# EAGLE design polarshield v1.4 (EAGLE 6.4)
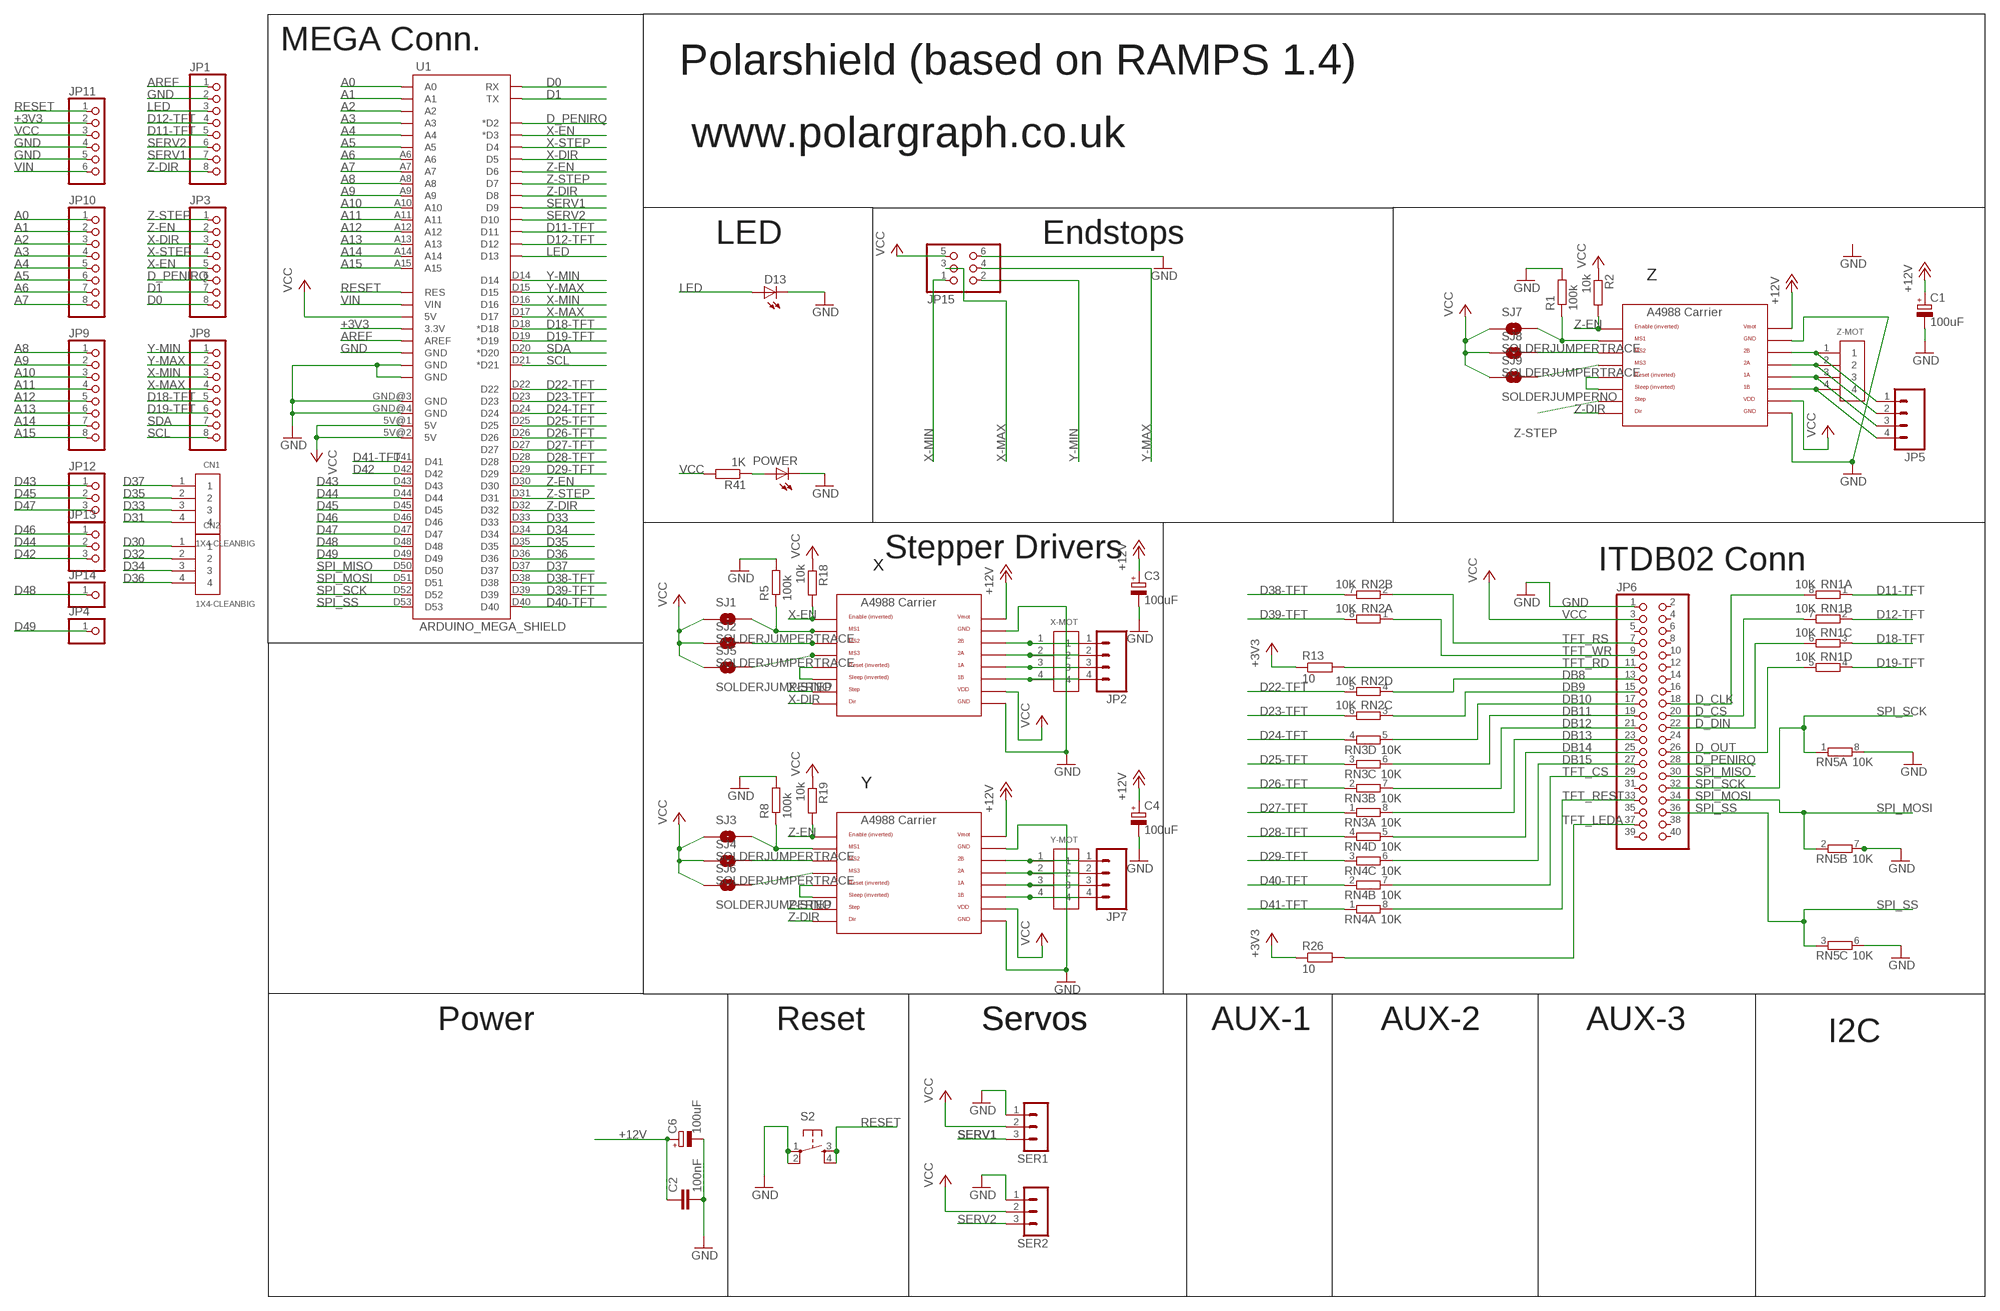
[diagram p0: schematic, sheet 1]

## Parts
C1  100uF  CPOL-EU153CLV-0605  [153CLV-0605]
C2  100nF  C-EUC0805  [C0805]
C3  100uF  CPOL-EU153CLV-0605  [153CLV-0605]
C4  100uF  CPOL-EU153CLV-0605  [153CLV-0605]
C6  100uF  CPOL-EU153CLV-0605  [153CLV-0605]
CN1  1X4-CLEANBIG  [1X04-CLEANBIG]
CN2  1X4-CLEANBIG  [1X04-CLEANBIG]
D13  LEDCHIP-LED0805  [CHIP-LED0805]
JP1  PINHD-1X8CLEANBIG  [1X08-CLEANBIG]
JP2  M04SCREW  [SCREWTERMINAL-3.5MM-4]
JP3  PINHD-1X8CLEANBIG  [1X08-CLEANBIG]
JP4  PINHD-1X1CB  [1X01-CLEANBIG]
JP5  M04SCREW  [SCREWTERMINAL-3.5MM-4]
JP6  PINHD-2X20  [2X20]
JP7  M04SCREW  [SCREWTERMINAL-3.5MM-4]
JP8  PINHD-1X8CLEANBIG  [1X08-CLEANBIG]
JP9  PINHD-1X8CLEANBIG  [1X08-CLEANBIG]
JP10  PINHD-1X8CLEANBIG  [1X08-CLEANBIG]
JP11  PINHD-1X6CB  [1X06-CLEANBIG]
JP12  PINHD-1X3CB  [1X03-CLEANBIG]
JP13  PINHD-1X3CB  [1X03-CLEANBIG]
JP14  PINHD-1X1CB  [1X01-CLEANBIG]
JP15  PINHD-2X3  [2X03]
POWER  LEDCHIP-LED0805  [CHIP-LED0805]
R1  100k  R-EU_R0805  [R0805]
R2  10k  R-EU_R0805  [R0805]
R5  100k  R-EU_R0805  [R0805]
R8  100k  R-EU_R0805  [R0805]
R13  10  R-EU_R0805  [R0805]
R18  10k  R-EU_R0805  [R0805]
R19  10k  R-EU_R0805  [R0805]
R26  10  R-EU_R0805  [R0805]
R41  1K  R-EU_R0805  [R0805]
RN1  10K  4R-NEXBS8V  [EXBS8V]
RN2  10K  4R-NEXBS8V  [EXBS8V]
RN3  10K  4R-NEXBS8V  [EXBS8V]
RN4  10K  4R-NEXBS8V  [EXBS8V]
RN5  10K  4R-NEXBS8V  [EXBS8V]
S2  TAC_SWITCHPTH  [TACTILE-PTH]
SER1  3PIN-HEADER  [3PIN-HEADER]
SER2  3PIN-HEADER  [3PIN-HEADER]
SJ1  SOLDERJUMPERTRACE  [SJ_2S-TRACE]
SJ2  SOLDERJUMPERTRACE  [SJ_2S-TRACE]
SJ3  SOLDERJUMPERTRACE  [SJ_2S-TRACE]
SJ4  SOLDERJUMPERTRACE  [SJ_2S-TRACE]
SJ5  SOLDERJUMPERNO  [SJ_2S-NO]
SJ6  SOLDERJUMPERNO  [SJ_2S-NO]
SJ7  SOLDERJUMPERTRACE  [SJ_2S-TRACE]
SJ8  SOLDERJUMPERTRACE  [SJ_2S-TRACE]
SJ9  SOLDERJUMPERNO  [SJ_2S-NO]
U1  ARDUINO_MEGA_SHIELD  [ARDUINO_MEGA_SHIELD]
U$1  A4988BREAKOUT  [A4988BREAKOUT]
U$6  A4988BREAKOUT  [A4988BREAKOUT]
U$7  A4988BREAKOUT  [A4988BREAKOUT]
X-MOT  1X4-BIG  [1X04-BIG]
Y-MOT  1X4-BIG  [1X04-BIG]
Z-MOT  1X4-BIG  [1X04-BIG]

## Nets
+3V3: JP11.2 R13.1 R26.1 U1.3.3V
+12V [vcc]: C1.+ C2.1 C3.+ C4.+ C6.+ U$1.VMOT U$6.VMOT U$7.VMOT
A0: JP10.1 U1.A0
A1: JP10.2 U1.A1
A2: JP10.3 U1.A2
A3: JP10.4 U1.A3
A4: JP10.5 U1.A4
A5: JP10.6 U1.A5
A6: JP10.7 U1.A6
A7: JP10.8 U1.A7
A8: JP9.1 U1.A8
A9: JP9.2 U1.A9
A10: JP9.3 U1.A10
A11: JP9.4 U1.A11
A12: JP9.5 U1.A12
A13: JP9.6 U1.A13
A14: JP9.7 U1.A14
A15: JP9.8 U1.A15
AREF: JP1.1 U1.AREF
D0: JP3.8 U1.RX
D1: JP3.7 U1.TX
D11-TFT: JP1.5 RN1.1 U1.D11
D12-TFT: JP1.4 RN1.2 U1.D12
D18-TFT: JP8.5 RN1.3 U1.D18(*D18)
D19-TFT: JP8.6 RN1.4 U1.D19(*D19)
D22-TFT: RN2.5 U1.D22
D23-TFT: RN2.6 U1.D23
D24-TFT: RN3.4 U1.D24
D25-TFT: RN3.3 U1.D25
D26-TFT: RN3.2 U1.D26
D27-TFT: RN3.1 U1.D27
D28-TFT: RN4.4 U1.D28
D29-TFT: RN4.3 U1.D29
D30: CN2.1
D31: CN1.4
D32: CN2.2
D33: CN1.3 U1.D33
D34: CN2.3 U1.D34
D35: CN1.2 U1.D35
D36: CN2.4 U1.D36
D37: CN1.1 U1.D37
D38-TFT: RN2.7 U1.D38
D39-TFT: RN2.8 U1.D39
D40-TFT: RN4.2 U1.D40
D41-TFT: RN4.1 U1.D41
D42: JP13.3 U1.D42
D43: JP12.1 U1.D43
D44: JP13.2 U1.D44
D45: JP12.2 U1.D45
D46: JP13.1 U1.D46
D47: JP12.3 U1.D47
D48: JP14.1 U1.D48
D49: JP4.1 U1.D49
D_CLK: JP6.18 RN1.8
D_CS: JP6.20 RN1.7
D_DIN: JP6.22 RN1.6
D_OUT: JP6.26 RN1.5
D_PENIRQ: JP3.6 JP6.28 U1.D2(*D2)
DB8: JP6.13 RN2.4
DB9: JP6.15 RN2.3
DB10: JP6.17 RN3.5
DB11: JP6.19 RN3.6
DB12: JP6.21 RN3.7
DB13: JP6.23 RN3.8
DB14: JP6.25 RN4.5
DB15: JP6.27 RN4.6
GND: C1.- C2.2 C3.- C4.- C6.- D13.C JP1.2 JP6.1 JP11.4 JP11.5 JP15.6 POWER.C R1.2 R5.2 R8.2 RN5.6 RN5.7 RN5.8 S2.1 S2.2 SER1.1 SER2.1 U1.GND@0(GND) U1.GND@1(GND) U1.GND@2(GND) U1.GND@3(GND) U1.GND@4(GND) U$1.GND U$1.GND@0(GND) U$6.GND U$6.GND@0(GND) U$7.GND U$7.GND@0(GND)
LED: D13.A JP1.3 U1.D13
N$1: U$6.RST U$6.SLP(SLEEP)
N$2: POWER.A R41.1
N$3: R5.1 SJ1.2 U$6.MS1
N$4: SJ8.2 U$1.MS2
N$5: SJ9.2 U$1.MS3
N$6: R1.1 SJ7.2 U$1.MS1
N$7: JP5.1 U$1.2B Z-MOT.1
N$8: JP5.2 U$1.2A Z-MOT.2
N$9: JP5.3 U$1.1A Z-MOT.3
N$10: SJ2.2 U$6.MS2
N$11: JP5.4 U$1.1B Z-MOT.4
N$12: SJ5.2 U$6.MS3
N$13: U$7.RST U$7.SLP(SLEEP)
N$14: U$1.RST U$1.SLP(SLEEP)
N$17: SJ4.2 U$7.MS2
N$21: JP2.1 U$6.2B X-MOT.1
N$22: JP2.2 U$6.2A X-MOT.2
N$26: JP2.3 U$6.1A X-MOT.3
N$27: JP2.4 U$6.1B X-MOT.4
N$28: JP7.1 U$7.2B Y-MOT.1
N$29: JP7.2 U$7.2A Y-MOT.2
N$30: JP7.3 U$7.1A Y-MOT.3
N$31: SJ6.2 U$7.MS3
N$33: R8.1 SJ3.2 U$7.MS1
N$36: JP7.4 U$7.1B Y-MOT.4
RESET: JP11.1 S2.3 S2.4 U1.RES
SCL: JP8.8 U1.D21(*D21)
SDA: JP8.7 U1.D20(*D20)
SERV1: JP1.7 SER1.3 U1.D9
SERV2: JP1.6 SER2.3 U1.D10
SPI_MISO: JP6.30 U1.D50
SPI_MOSI: JP6.34 RN5.2 U1.D51
SPI_SCK: JP6.32 RN5.1 U1.D52
SPI_SS: JP6.36 RN5.3 U1.D53
TFT_CS: JP6.29 RN4.7
TFT_LEDA: JP6.37 R26.2
TFT_RD: JP6.11 R13.2
TFT_REST: JP6.33 RN4.8
TFT_RS: JP6.7 RN2.2
TFT_WR: JP6.9 RN2.1
VCC: JP6.3 JP11.3 JP15.5 R2.1 R18.1 R19.1 R41.2 SER1.2 SER2.2 SJ1.1 SJ2.1 SJ3.1 SJ4.1 SJ5.1 SJ6.1 SJ7.1 SJ8.1 SJ9.1 U1.5V@0(5V) U1.5V@1(5V) U1.5V@2(5V) U$1.VDD U$6.VDD U$7.VDD
VIN [vcc]: JP11.6 U1.VIN
X-DIR: JP3.3 U1.D5 U$6.DIR
X-EN: JP3.5 R18.2 U1.D3(*D3) U$6.EN
X-MAX: JP8.4 JP15.3 U1.D17
X-MIN: JP8.3 JP15.1 U1.D16
X-STEP: JP3.4 U1.D4 U$6.STEP
Y-MAX: JP8.2 JP15.4 U1.D15
Y-MIN: JP8.1 JP15.2 U1.D14
Z-DIR: JP1.8 U1.D8 U1.D32 U$1.DIR U$7.DIR
Z-EN: JP3.2 R2.2 R19.2 U1.D6 U1.D30 U$1.EN U$7.EN
Z-STEP: JP3.1 U1.D7 U1.D31 U$1.STEP U$7.STEP
Unconnected: JP6.2 JP6.4 JP6.5 JP6.6 JP6.8 JP6.10 JP6.12 JP6.14 JP6.16 JP6.24 JP6.31 JP6.35 JP6.38 JP6.39 JP6.40 RN5.4 RN5.5

## Notes on the sheet
- MEGA Conn.
- Polarshield (based on RAMPS 1.4)
- www.polargraph.co.uk
- LED | Endstops
- Z
- Stepper Drivers
- X | ITDB02 Conn
- Y
- Power | Reset | Servos | Servos | AUX-1 | AUX-2 | AUX-3
- I2C

## Library data of the parts
C1 C3 C4 C6 = rcl:CPOL-EU: POLARIZED CAPACITOR, European symbol
C2 = resistor:C-EU: CAPACITOR, European symbol
CN1 CN2 X-MOT Y-MOT Z-MOT = adafruit:1X4: 4-pin connector
D13 POWER = led:LED: LED OSRAM: - CHIPLED LG R971, LG N971, LY N971, LG Q971, LY Q971, LO R971, LY R971 LH N974, LH R974 LS Q976, LO Q976, LY Q976 LO Q996 - Hyper CHIPLED LW Q18S LB Q993, LB Q99A, LB R99A - SideLED LS A670, LO A670, LY A670, LG A670, LP A670 LB A673, LV A673, LT A673, LW A673 LH A674 LY A675 LS A676, LA A676, LO A676, LY A676, LW A676 LS A679, LY A679, LG A679 - Hyper Micro SIDELED® LS Y876, LA Y876, LO Y876, LY Y876 LT Y87S - SmartLED LW L88C, LW L88S LB L89C, LB L89S, LG L890 LS L89K, LO L89K, LY L89K LS L896, LA L896, LO L896, LY L896 - TOPLED LS T670, LO T670, LY T670, LG T670, LP T670 LSG T670, LSP T670, LSY T670, LOP T670, LYG T670 LG T671, LOG T671, LSG T671 LB T673, LV T673, LT T673, LW T673 LH T674 LS T676, LA T676, LO T676, LY T676, LB T676, LH T676, LSB T676, LW T676 LB T67C, LV T67C, LT T67C, LS T67K, LO T67K, LY T67K, LW E67C LS E67B, LA E67B, LO E67B, LY E67B, LB E67C, LV E67C, LT E67C LW T67C LS T679, LY T679, LG T679 LS T770, LO T770, LY T770, LG T770, LP T770 LB T773, LV T773, LT T773, LW T773 LH T774 LS E675, LA E675, LY E675, LS T675 LS T776, LA T776, LO T776, LY T776, LB T776 LHGB T686 LT T68C, LB T68C - Hyper Mini TOPLED® LB M676 - Mini TOPLED Santana® LG M470 LS M47K, LO M47K, LY M47K Source: http://www.osram.convergy.de LUXEON: - LUMILED® LXK2-PW12-R00, LXK2-PW12-S00, LXK2-PW14-U00, LXK2-PW14-V00 LXK2-PM12-R00, LXK2-PM12-S00, LXK2-PM14-U00 LXK2-PE12-Q00, LXK2-PE12-R00, LXK2-PE12-S00, LXK2-PE14-T00, LXK2-PE14-U00 LXK2-PB12-K00, LXK2-PB12-L00, LXK2-PB12-M00, LXK2-PB14-N00, LXK2-PB14-P00, LXK2-PB14-Q00 LXK2-PR12-L00, LXK2-PR12-M00, LXK2-PR14-Q00, LXK2-PR14-R00 LXK2-PD12-Q00, LXK2-PD12-R00, LXK2-PD12-S00 LXK2-PH12-R00, LXK2-PH12-S00 LXK2-PL12-P00, LXK2-PL12-Q00, LXK2-PL12-R00 Source: www.luxeon.com KINGBRIGHT: KA-3528ASYC Source: www.kingbright.com
JP1 JP3 JP8-JP10 = adafruit:PINHD-1X8: PIN HEADER
JP2 JP5 JP7 = SparkFun:M04: Header 4 Standard 4-pin 0.1" header. Use with straight break away headers (SKU : PRT-00116), right angle break away headers (PRT-00553), swiss pins (PRT-00743), machine pins (PRT-00117), and female headers (PRT-00115). Molex polarized connector foot print use with SKU : PRT-08231 with associated crimp pins and housings. 1MM SMD Version SKU: PRT-10208
JP4 JP14 = adafruit:PINHD-1X1: Pin header 1x1 for 0.1" spacing With round pins
JP6 = pinhead:PINHD-2X20: PIN HEADER
JP11 = adafruit:PINHD-1X6: PIN HEADER
JP12 JP13 = adafruit:PINHD-1X3: PIN HEADER
JP15 = pinhead:PINHD-2X3: PIN HEADER
R1 R2 R5 R8 R18 R19 R41 = rcl:R-EU_: RESISTOR, European symbol
R13 R26 = resistor:R-EU_: RESISTOR, European symbol
RN1-RN5 = resistor-dil:4R-N: Array Chip Resistor Source: RS Component / Phycomp; OC_FARNELL: unknown; OC_NEWARK: unknown
S2 = SparkFun:TAC_SWITCH: Momentary Switch Button commonly used for reset or general input. Spark Fun Electronics SKU : COM-00097
SER1 SER2 = ultimachine:3PIN-HEADER: PIN HEADER
SJ1-SJ9 = SparkFun:SOLDERJUMPER: Solder Jumper Standard SMD solder jumper. Used to automate production. Two varients : Normally Open and Normally Closed are the same, but have different paste layers. NC will have a large amount of paste and should jumper during reflow.
U1 = RepRapjr:ARDUINO_MEGA_SHIELD
U$1 U$6 U$7 = RepRapjr:A4988BREAKOUT

## Net classes
1 gnd12: width 2.54 mm
2 gnd5: width 2.54 mm
3 vmot: width 2.54 mm
4 vcc: width 0.406 mm
5 signal: width 0.406 mm

## Board
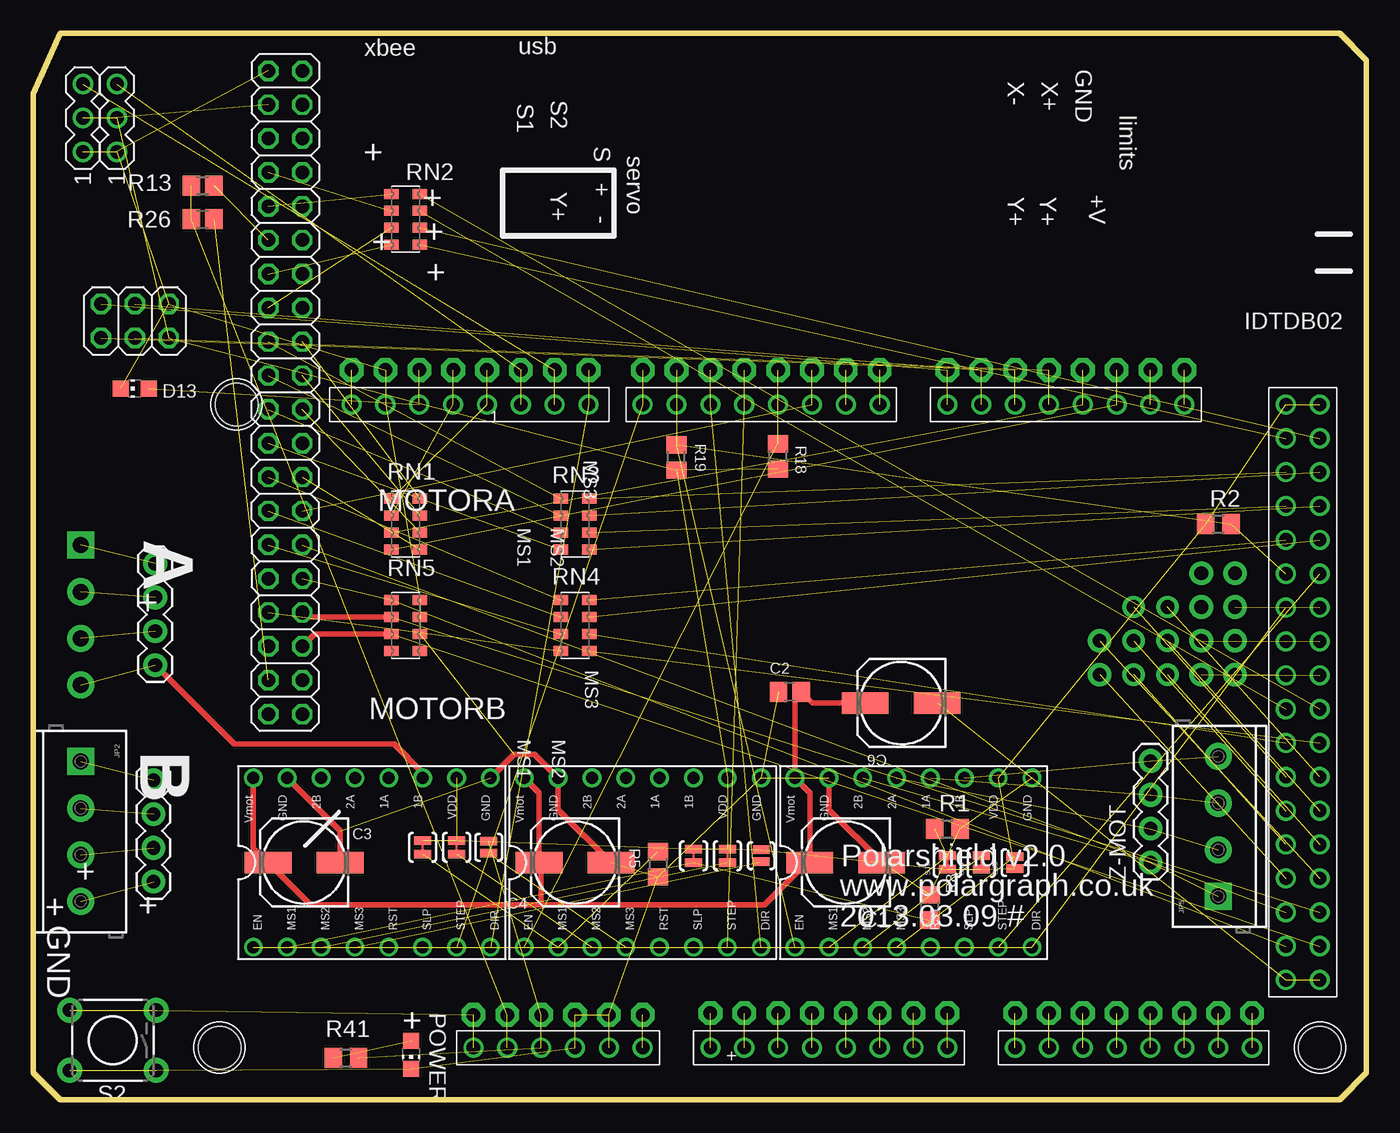
[diagram p1: board, top side]
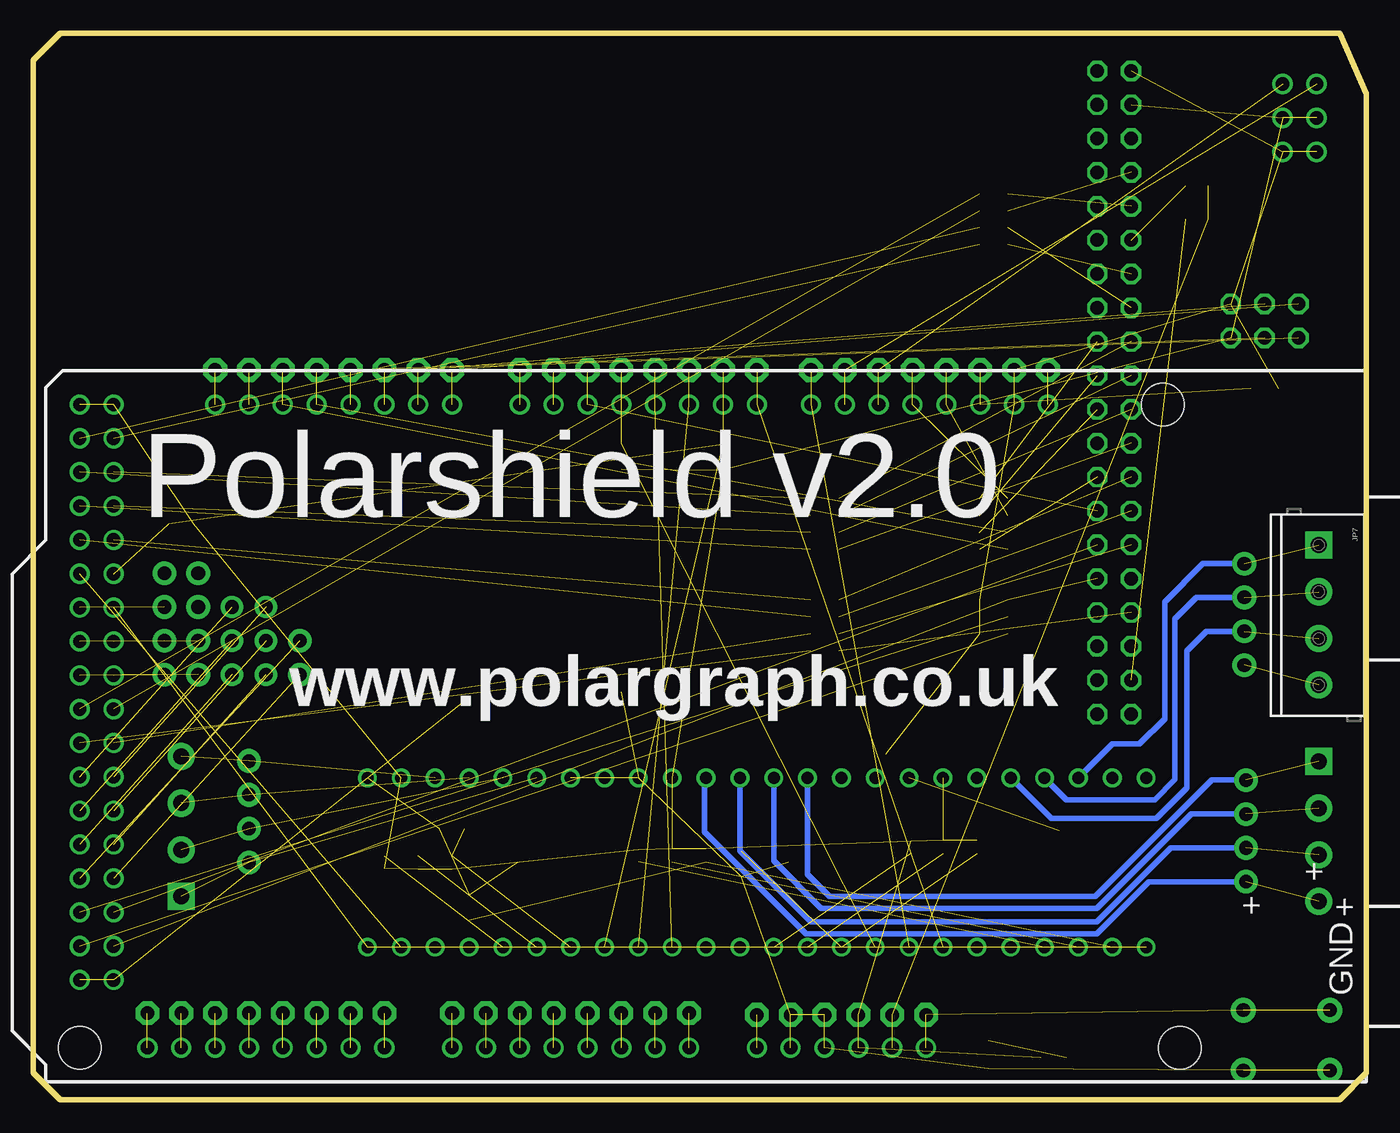
[diagram p2: board, bottom side, seen from below]

Size 100 x 80 mm. Coordinates in mm from the lower left corner, seen from the top.
Outline: 100,2 100,78 98,80 2,80 0,75.46 0,2 2,0 98,0 100,2
Copper layers (1*16): Top 0.035mm / dielectric 1.5mm / Bottom 0.035mm
Design rules "ITead_rule": minimum track width 6mil, minimum drill 12mil, track to track 6mil, track to pad 6mil, pad to pad 6mil, via to via 6mil, smd to smd 0mil, copper to edge 10mil, drill to drill 10mil, minimum pad ring 10mil, minimum via ring 6mil, stop-mask expansion 2mil, vias tented up to drill 100mil, thermal gap 10mil

### Footprints (pad centres in the part's own frame; a part is rotated, then mirrored left to right if it is on the bottom)
153CLV-0605 = smd 3.5 x 1.6: + 2.7,0; - -2.7,0
C0805 = smd 1.3 x 1.5: 1 -0.85,0; 2 0.85,0
1X04-CLEANBIG = drill 1.016 pad 1.778: 1 -3.81,0; 2 -1.27,0; 3 1.27,0; 4 3.81,0
CHIP-LED0805 = smd 1.2 x 1.2: A 0,-1.05; C 0,1.05
1X08-CLEANBIG = drill 1.016 pad 1.778 octagon: 1 -8.89,0; 2 -6.35,0; 3 -3.81,0; 4 -1.27,0; 5 1.27,0; 6 3.81,0; 7 6.35,0; 8 8.89,0
SCREWTERMINAL-3.5MM-4 = drill 1.2 pad 2.032 square: 1 0,0 | drill 1.2 pad 2.032: 2 3.5,0; 3 7,0; 4 10.5,0
1X01-CLEANBIG = drill 1.016 pad 1.778: 1 0,0
2X20 = drill 1.016 octagon: 1 -24.13,-1.27; 2 -24.13,1.27; 3 -21.59,-1.27; 4 -21.59,1.27; 5 -19.05,-1.27; 6 -19.05,1.27; 7 -16.51,-1.27; 8 -16.51,1.27; 9 -13.97,-1.27; 10 -13.97,1.27; 11 -11.43,-1.27; 12 -11.43,1.27; 13 -8.89,-1.27; 14 -8.89,1.27; 15 -6.35,-1.27; 16 -6.35,1.27; 17 -3.81,-1.27; 18 -3.81,1.27; 19 -1.27,-1.27; 20 -1.27,1.27; 21 1.27,-1.27; 22 1.27,1.27; 23 3.81,-1.27; 24 3.81,1.27; 25 6.35,-1.27; 26 6.35,1.27; 27 8.89,-1.27; 28 8.89,1.27; 29 11.43,-1.27; 30 11.43,1.27; 31 13.97,-1.27; 32 13.97,1.27; 33 16.51,-1.27; 34 16.51,1.27; 35 19.05,-1.27; 36 19.05,1.27; 37 21.59,-1.27; 38 21.59,1.27; 39 24.13,-1.27; 40 24.13,1.27
1X06-CLEANBIG = drill 1.016 pad 1.778 octagon: 1 -6.35,0; 2 -3.81,0; 3 -1.27,0; 4 1.27,0; 5 3.81,0; 6 6.35,0
1X03-CLEANBIG = drill 1.016 pad 1.676: 1 -2.54,0; 2 0,0; 3 2.54,0
2X03 = drill 1.016 octagon: 1 -2.54,-1.27; 2 -2.54,1.27; 3 0,-1.27; 4 0,1.27; 5 2.54,-1.27; 6 2.54,1.27
R0805 = smd 1.3 x 1.5: 1 -0.95,0; 2 0.95,0
R0805' = smd 1.3 x 1.5: 1 -0.85,0; 2 0.85,0
EXBS8V = smd 0.75 x 1.1: 1 -1.905,-1.07; 2 -0.635,-1.07; 3 0.635,-1.07; 4 1.905,-1.07; 5 1.905,1.07; 6 0.635,1.07; 7 -0.635,1.07; 8 -1.905,1.07
TACTILE-PTH = drill 1.016 pad 1.88: 1 -3.251,2.261; 2 3.251,2.261; 3 -3.251,-2.261; 4 3.251,-2.261
3PIN-HEADER = drill 1.016: 1 -2.54,0; 2 0,0; 3 2.54,0
SJ_2S-TRACE = smd 0.635 x 1.27: 1 -0.508,0; 2 0.508,0
SJ_2S-NO = smd 0.635 x 1.27: 1 -0.45,0; 2 0.45,0
ARDUINO_MEGA_SHIELD = drill 1 pad 1.422: 3.3V 35.56,2.54; 5V@0 38.1,2.54; 5V@1 93.98,50.8; 5V@2 96.52,50.8; A0 50.8,2.54; A1 53.34,2.54; A2 55.88,2.54; A3 58.42,2.54; A4 60.96,2.54; A5 63.5,2.54; A6 66.04,2.54; A7 68.58,2.54; A8 73.66,2.54; A9 76.2,2.54; A10 78.74,2.54; A11 81.28,2.54; A12 83.82,2.54; A13 86.36,2.54; A14 88.9,2.54; A15 91.44,2.54; AREF 23.876,50.8; D2 58.42,50.8; D3 55.88,50.8; D4 53.34,50.8; D5 50.8,50.8; D6 48.26,50.8; D7 45.72,50.8; D8 41.656,50.8; D9 39.116,50.8; D10 36.576,50.8; D11 34.036,50.8; D12 31.496,50.8; D13 28.956,50.8; D14 68.58,50.8; D15 71.12,50.8; D16 73.66,50.8; D17 76.2,50.8; D18 78.74,50.8; D19 81.28,50.8; D20 83.82,50.8; D21 86.36,50.8; D22 93.98,48.26; D23 96.52,48.26; D24 93.98,45.72; D25 96.52,45.72; D26 93.98,43.18; D27 96.52,43.18; D28 93.98,40.64; D29 96.52,40.64; D30 93.98,38.1; D31 96.52,38.1; D32 93.98,35.56; D33 96.52,35.56; D34 93.98,33.02; D35 96.52,33.02; D36 93.98,30.48; D37 96.52,30.48; D38 93.98,27.94; D39 96.52,27.94; D40 93.98,25.4; D41 96.52,25.4; D42 93.98,22.86; D43 96.52,22.86; D44 93.98,20.32; D45 96.52,20.32; D46 93.98,17.78; D47 96.52,17.78; D48 93.98,15.24; D49 96.52,15.24; D50 93.98,12.7; D51 96.52,12.7; D52 93.98,10.16; D53 96.52,10.16; GND@0 40.64,2.54; GND@1 43.18,2.54; GND@2 26.416,50.8; GND@3 93.98,7.62; GND@4 96.52,7.62; RES 33.02,2.54; RX 63.5,50.8; TX 60.96,50.8; VIN 45.72,2.54 | hole 3.2: 96.52,2.54; 13.97,2.54; 15.24,50.8
A4988BREAKOUT = drill 0.9: 1A 8.89,1.27; 1B 11.43,1.27; 2A 6.35,1.27; 2B 3.81,1.27; DIR 16.51,-11.43; EN -1.27,-11.43; GND 16.51,1.27; GND@0 1.27,1.27; MS1 1.27,-11.43; MS2 3.81,-11.43; MS3 6.35,-11.43; RST 8.89,-11.43; SLP 11.43,-11.43; STEP 13.97,-11.43; VDD 13.97,1.27; VMOT -1.27,1.27
1X04-BIG = drill 1.016 pad 1.778: 1 0,0; 2 2.54,0; 3 5.08,0; 4 7.62,0

### Placement (x,y rotation side)
C1  60.96,17.78 180 top
C2  56.76,30.59 180 top
C3  20.32,17.78 180 top
C4  40.64,17.78 180 top
C6  65.12,29.74 180 top
CN1  90.17,35.69 90 top
CN2  87.63,35.69 270 bottom
D13  7.62,53.34 90 top
JP1  32.77,54.74 0 top
JP2  3.56,25.36 270 top
JP3  54.61,54.74 0 top
JP4  80.01,34.42 0 top
JP5  88.9,15.24 90 top
JP6  18.9,53.05 270 top
JP7  3.56,41.6 270 bottom
JP8  77.47,54.74 0 top
JP9  82.55,6.48 0 top
JP10  59.69,6.48 0 top
JP11  39.37,6.35 0 top
JP12  85.09,34.42 270 bottom
JP13  82.55,34.42 90 top
JP14  80.01,31.88 0 top
JP15  7.62,58.42 0 top
POWER  28.34,3.35 180 top
R1  68.58,20.32 0 top
R2  88.9,43.18 0 top
R5  46.86,17.65 270 top
R8  67.28,14.41 90 top
R13  10  [R0805']  12.7,68.58 0 top
R18  55.88,48.26 90 top
R19  48.24,48.18 90 top
R26  10  [R0805']  12.7,66.04 0 top
R41  23.45,3.13 0 top
RN1  27.94,43.18 270 top
RN2  27.94,66.04 270 top
RN3  40.64,43.18 90 top
RN4  40.64,35.56 90 top
RN5  27.94,35.56 270 top
S2  5.97,4.45 180 top
SER1  3.72,73.65 90 top
SER2  6.26,73.65 90 top
SJ1  29.21,18.92 270 top
SJ2  31.75,18.92 270 top
SJ3  49.53,18.29 270 top
SJ4  52.07,18.29 270 top
SJ5  34.16,18.92 270 top
SJ6  54.61,18.29 270 top
SJ7  68.58,17.78 90 top
SJ8  71.12,17.78 90 top
SJ9  73.66,17.78 90 top
U1  0,1.35 0 top
U$1  58.42,22.86 0 top
U$6  38.1,22.86 0 top
U$7  17.78,22.86 0 top
X-MOT  9.02,23.96 270 top
Y-MOT  9.14,40.21 270 top
Z-MOT  83.82,17.78 90 top

### Tracks (layer width: path | path; a pad name or v marks a point on that pad's centre or on a via)
+3V3  (3 unrouted)
+12V
  Top 0.406: U$7.VMOT 16.51,18.89 C3.+ 20.8,14.61 38.1,14.61 | U$6.VMOT 37.94,23.02 C4.+ 38.1,17.62 38.1,14.61 | 38.1,14.61 54.86,14.61 58.04,17.78 C1.+ 58.26,23.02 U$1.VMOT 57.15,30.14 C2.1 58.46,29.74 C6.+
A0  (1 unrouted)
A1  (1 unrouted)
A2  (1 unrouted)
A3  (1 unrouted)
A4  (1 unrouted)
A5  (1 unrouted)
A6  (1 unrouted)
A7  (1 unrouted)
A8  (1 unrouted)
A9  (1 unrouted)
A10  (1 unrouted)
A11  (1 unrouted)
A12  (1 unrouted)
A13  (1 unrouted)
A14  (1 unrouted)
A15  (1 unrouted)
AREF  (1 unrouted)
D0  (1 unrouted)
D1  (1 unrouted)
D11-TFT  (2 unrouted)
D12-TFT  (2 unrouted)
D18-TFT  (2 unrouted)
D19-TFT  (2 unrouted)
D22-TFT  (1 unrouted)
D23-TFT  (1 unrouted)
D24-TFT  (1 unrouted)
D25-TFT  (1 unrouted)
D26-TFT  (1 unrouted)
D27-TFT  (1 unrouted)
D28-TFT  (1 unrouted)
D29-TFT  (1 unrouted)
D33  (1 unrouted)
D34  (1 unrouted)
D35  (1 unrouted)
D36  (1 unrouted)
D37  (1 unrouted)
D38-TFT  (1 unrouted)
D39-TFT  (1 unrouted)
D40-TFT  (1 unrouted)
D41-TFT  (1 unrouted)
D42  (1 unrouted)
D43  (1 unrouted)
D44  (1 unrouted)
D45  (1 unrouted)
D46  (1 unrouted)
D47  (1 unrouted)
D48  (1 unrouted)
D49  (1 unrouted)
D_CLK  (1 unrouted)
D_CS  (1 unrouted)
D_DIN  (1 unrouted)
D_OUT  (1 unrouted)
D_PENIRQ  (2 unrouted)
DB8  (1 unrouted)
DB9  (1 unrouted)
DB10  (1 unrouted)
DB11  (1 unrouted)
DB12  (1 unrouted)
DB13  (1 unrouted)
DB14  (1 unrouted)
DB15  (1 unrouted)
GND  (28 unrouted)
  Top 0.406: U$7.GND@0 23.02,20.16 C3.- | U$7.GND 36.07,25.91 37.59,25.91 U$6.GND@0 39.37,21.75 C4.- | C1.- 59.69,21.75 U$1.GND@0
  pour Top (isolate 0.813): 106.68,-2.54 101.6,81.28 101.6,0 0,0
  pour Bottom (isolate 0.61): 106.68,-2.54 101.6,81.28 101.6,0 0,0
LED  (2 unrouted)
N$1  (1 unrouted)
N$2  (1 unrouted)
N$3  (2 unrouted)
N$4  (1 unrouted)
N$5  (1 unrouted)
N$6  (2 unrouted)
N$7  (2 unrouted)
N$8  (2 unrouted)
N$9  (2 unrouted)
N$10  (1 unrouted)
N$11  (2 unrouted)
N$12  (1 unrouted)
N$13  (1 unrouted)
N$14  (1 unrouted)
N$17  (1 unrouted)
N$21  (1 unrouted)
  Bottom 0.406: X-MOT.1 11.6,23.96 20.32,15.24 40.26,15.24 41.91,16.89 U$6.2B
N$22  (1 unrouted)
  Bottom 0.406: X-MOT.2 13.12,21.42 20.19,14.35 40.89,14.35 44.45,17.91 U$6.2A
N$26  (1 unrouted)
  Bottom 0.406: X-MOT.3 14.64,18.88 20.19,13.34 41.66,13.34 46.99,18.67 U$6.1A
N$27  (1 unrouted)
  Bottom 0.406: X-MOT.4 16.3,16.34 20.19,12.45 42.04,12.45 49.66,20.07 49.66,24 U$6.1B
N$28  (1 unrouted)
  Bottom 0.406: Y-MOT.1 12.24,40.21 15.11,37.34 15.11,28.57 17.02,26.67 19.05,26.67 U$7.2B
N$29  (1 unrouted)
  Bottom 0.406: Y-MOT.2 12.75,37.67 14.35,36.07 14.35,24 15.88,22.48 22.48,22.48 U$7.2A
N$30  (1 unrouted)
  Bottom 0.406: Y-MOT.3 11.99,35.13 13.46,33.66 13.46,23.37 15.75,21.08 23.62,21.08 U$7.1A
N$31  (1 unrouted)
N$33  (2 unrouted)
N$36  (1 unrouted)
  Top 0.406: Y-MOT.4 15.06,26.67 27.05,26.67 29.21,24.51 U$7.1B
RESET  (3 unrouted)
SCL  (1 unrouted)
SDA  (1 unrouted)
SERV1  (2 unrouted)
SERV2  (2 unrouted)
SPI_MISO  (1 unrouted)
SPI_MOSI  (1 unrouted)
  Top 0.406: JP6.34 20.52,36.2 RN5.2
SPI_SCK  (2 unrouted)
SPI_SS  (1 unrouted)
  Top 0.406: JP6.36 21.09,34.92 RN5.3
TFT_CS  (1 unrouted)
TFT_LEDA  (1 unrouted)
TFT_RD  (1 unrouted)
TFT_REST  (1 unrouted)
TFT_RS  (1 unrouted)
TFT_WR  (1 unrouted)
VCC  (23 unrouted)
VIN  (1 unrouted)
X-DIR  (2 unrouted)
X-EN  (3 unrouted)
X-MAX  (2 unrouted)
X-MIN  (2 unrouted)
X-STEP  (2 unrouted)
Y-MAX  (2 unrouted)
Y-MIN  (2 unrouted)
Z-DIR  (4 unrouted)
Z-EN  (6 unrouted)
Z-STEP  (4 unrouted)

### Text on the board
_tsilk: xbee | usb | GND | X- | X+ | S1 | S2 | limits | S | servo | + | + | Y+ | Y+ | Y+ | +V | + | - | + | + | + | + | IDTDB02 | 1 | MS3 | MOTORA | MS1 | MS2 | A | + | MS3 | MOTORB | MS1 | MS2 | B | Polarshield v2.0 | + | www.polargraph.co.uk | + | + | GND | 2013.03.09 # | + | +
_bsilk: Polarshield v2.0 | www.polargraph.co.uk | + | + | + | GND